# Altium project PCB_Project1.PrjPCB
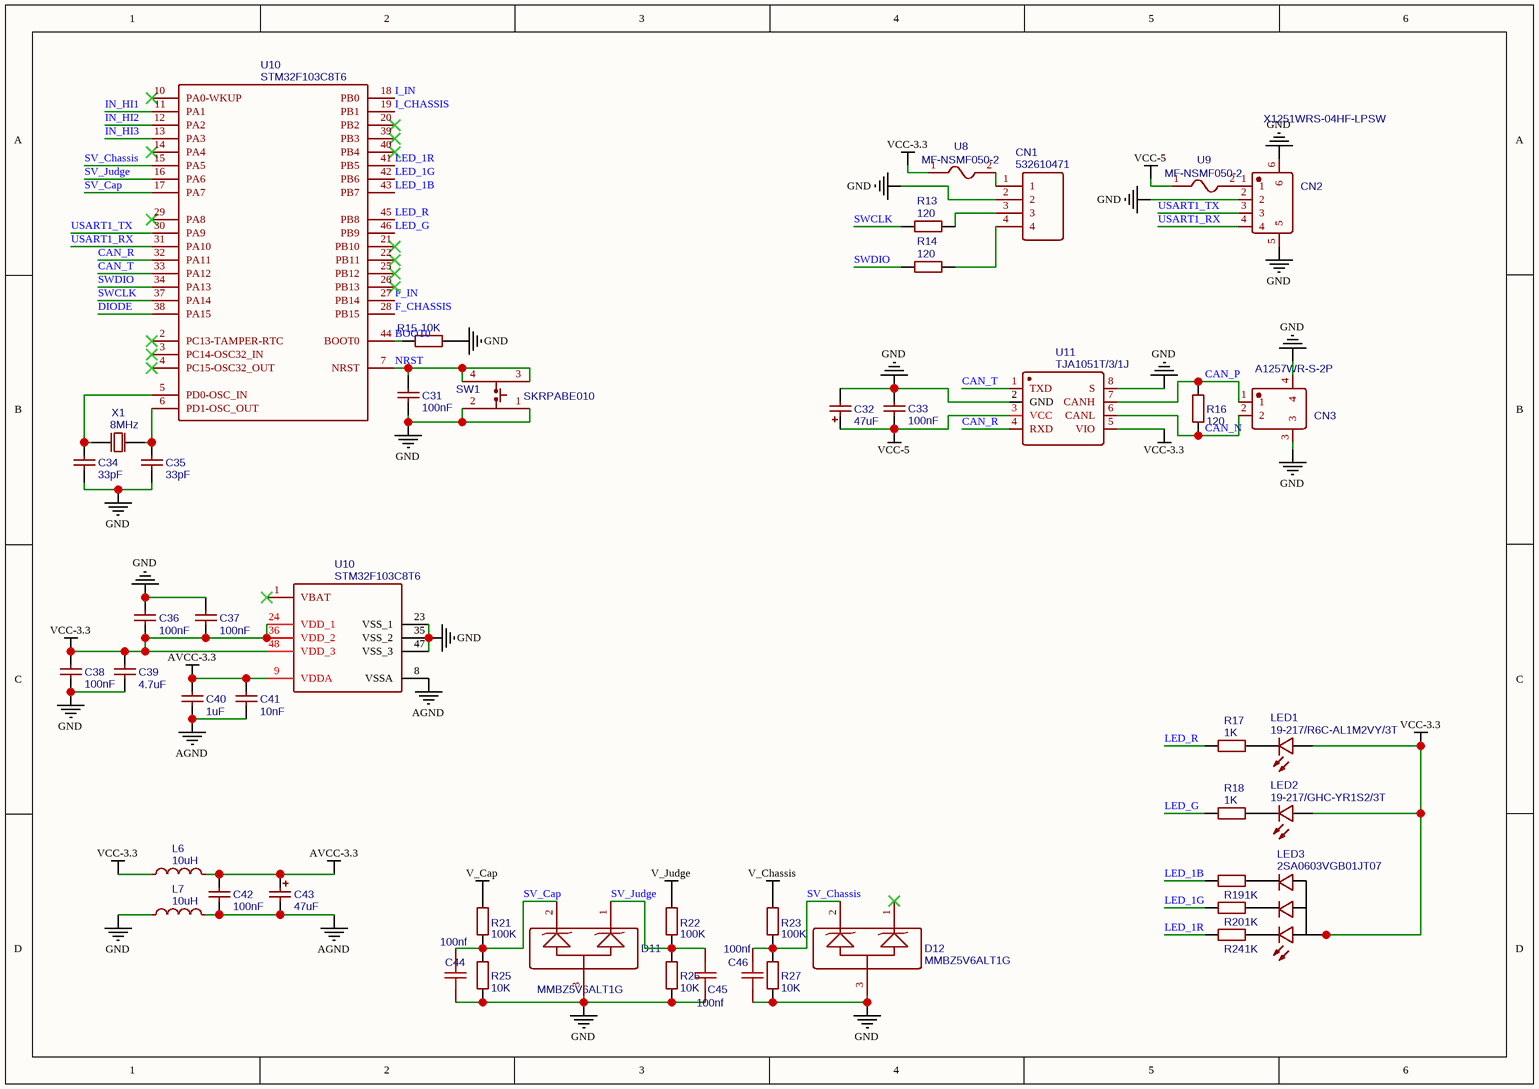
[diagram p0: F103.SchDoc]
2 sheets, 121 parts. Net scope: global (net labels, ports and power ports of the same name join across sheets).
Board file: SC1.0.pcbdoc
Sheets:
  F103.SchDoc
  SWITCH.SchDoc

## Sheet F103.SchDoc
size 287 x 202 mm

### Parts
(Parts that share a designator on the sheet are numbered #1, #2 ... from top to bottom, then left to right.)
C31  100nF  [C0603]
C32  47uF  [CASE-A_3216]
C33  100nF  [R0603]
C34  33pF  [C0603]
C35  33pF  [C0603]
C36  100nF  [C0603]
C37  100nF  [C0603]
C38  100nF  [C0603]
C39  4.7uF  [C0805]
C40  1uF  [C0603]
C41  10nF  [C0603]
C42  100nF  [C0603]
C43  47uF  [CASE-A_3216]
C44  100nf  [C0603]
C45  100nf  [C0603]
C46  100nf  [C0603]
CN1  532610471  [SMD-10.15X4.8-4P]
CN2  X1251WRS-04HF-LPSW  [CONN-TH_4PIN-H-MALE-PITCH1.25-L_X1251WRS-04HF-LPSW]
CN3  A1257WR-S-2P  [CONN-SMD_A1257WR-S-2P]
D11  MMBZ5V6ALT1G  [SOT-23(SOT-23-3)]
D12  MMBZ5V6ALT1G  [SOT-23(SOT-23-3)]
L6  10uH  [L0603]
L7  10uH  [L0603]
LED1  19-217/R6C-AL1M2VY/3T  [LED-0603]
LED2  19-217/GHC-YR1S2/3T  [LED-0603]
LED3  2SA0603VGB01JT07  [LED-SMD_4PIN-L1.60-W1.60-TL-FD]
R13  120  [R0603]
R14  120  [R0603]
R15  10K  [R0603]
R16  120  [R0603]
R17  1K  [R0603]
R18  1K  [R0603]
R19  1K  [R0603]
R20  1K  [R0603]
R21  100K  [R0603]
R22  100K  [R0603]
R23  100K  [R0603]
R24  1K  [R0603]
R25  10K  [R0603]
R26  10K  [R0603]
R27  10K  [R0603]
SW1  SKRPABE010  [KEY-SMD-4P_L4.2-W3.2-H2.5]
U8  MF-NSMF050-2  [FUSE-1206]
U9  MF-NSMF050-2  [FUSE-1206]
U10#1  STM32F103C8T6  [LQFP-48_7X7X05P]
U10#2  STM32F103C8T6  [LQFP-48_7X7X05P]
U11  TJA1051T/3/1J  [SOIC-8_150MIL]
X1  8MHz  [SMD-5032_2P]

### Nets
AGND: C40.1 C41.1 C42.1 C43.2 L7.2 U10#2.8(VSSA)
AVCC-3.3: C40.2 C41.2 C42.2 C43.1 L6.2 U10#2.9(VDDA)
GND: C31.1 C32.2 C33.2 C34.1 C35.1 C36.1 C37.2 C38.1 C39.1 C44.1 C45.1 C46.1 CN1.2 CN2.2 CN2.5 CN2.6 CN3.3 CN3.4 D11.3(A) D12.3(A) L7.1 R15.1 R25.1 R26.1 R27.1 SW1.1 SW1.2 U10#2.23(VSS_1) U10#2.35(VSS_2) U10#2.47(VSS_3) U11.2(GND) U11.8(S)
V_Cap: R21.1
V_Chassis: R23.1
V_Judge: R22.1
VCC-3.3: C36.2 C37.1 C38.2 C39.2 L6.1 LED1.1(A) LED2.1(A) LED3.1(A) U8.1 U10#2.24(VDD_1) U10#2.36(VDD_2) U10#2.48(VDD_3) U11.5(VIO)
VCC-5: C32.1 C33.1 U9.1 U11.3(VCC)
BOOT0: R15.2 U10#1.44(BOOT0)
CAN_N: CN3.2 R16.2 U11.6(CANL)
CAN_P: CN3.1 R16.1 U11.7(CANH)
CAN_R: U10#1.32(PA11) U11.4(RXD)
CAN_T: U10#1.33(PA12) U11.1(TXD)
DIODE: U10#1.38(PA15)
F_CHASSIS: U10#1.28(PB15)
F_IN: U10#1.27(PB14)
I_CHASSIS: U10#1.19(PB1)
I_IN: U10#1.18(PB0)
IN_HI1: U10#1.11(PA1)
IN_HI2: U10#1.12(PA2)
IN_HI3: U10#1.13(PA3)
LED_1B: R19.1 U10#1.43(PB7)
LED_1G: R20.1 U10#1.42(PB6)
LED_1R: R24.1 U10#1.41(PB5)
LED_G: R18.1 U10#1.46(PB9)
LED_R: R17.1 U10#1.45(PB8)
NRST: C31.2 SW1.3 SW1.4 U10#1.7(NRST)
SV_Cap: C44.2 D11.2(C) R21.2 R25.2 U10#1.17(PA7)
SV_Chassis: C46.2 D12.2(C) R23.2 R27.2 U10#1.15(PA5)
SV_Judge: C45.2 D11.1(C) R22.2 R26.2 U10#1.16(PA6)
SWCLK: R13.2 U10#1.37(PA14)
SWDIO: R14.2 U10#1.34(PA13)
USART1_RX: CN2.4 U10#1.31(PA10)
USART1_TX: CN2.3 U10#1.30(PA9)
NetC34_2: C34.2 U10#1.5(PD0-OSC_IN) X1.1(OSC1)
NetC35_2: C35.2 U10#1.6(PD1-OSC_OUT) X1.2(OSC2)
NetCN1_1: CN1.1 U8.2
NetCN1_3: CN1.3 R13.1
NetCN1_4: CN1.4 R14.1
NetCN2_1: CN2.1 U9.2
NetLED1_2: LED1.2(C) R17.2
NetLED2_2: LED2.2(C) R18.2
NetLED3_2: LED3.2(R) R24.2
NetLED3_3: LED3.3(B) R19.2
NetLED3_4: LED3.4(G) R20.2

Not connected (* = marked no-connect by the designer): D12 1(C)*; U10#1 2(PC13-TAMPER-RTC)* 3(PC14-OSC32_IN)* 4(PC15-OSC32_OUT)* 10(PA0-WKUP)* 14(PA4)* 20(PB2)* 21(PB10)* 22(PB11)* 25(PB12)* 26(PB13)* 29(PA8)* 39(PB3)* 40(PB4)*; U10#2 1(VBAT)*

### Library data of the parts
C31 C33 C36-C38 C42 = 100nF: BOM_Manufacturer Part: CL05B104KO5NNNC; BOM_Manufacturer: SAMSUNG; nameAlias: Capacitance; BOM_Supplier: LCSC; BOM_LCSC Assembly: Yes; BOM_Supplier Part: C1525; spicePre: C; spiceSymbolName: CL05B104KO5NNNC
C32 C43 = 47uF: BOM_Manufacturer: Xiangyee; BOM_Manufacturer Part: CA45-A010K476T; nameAlias: Capacitance; Contributor: LCSC; BOM_Supplier: LCSC; BOM_Supplier Part: C127069; BOM_LCSC Assembly: Yes; spicePre: C; spiceSymbolName: CA45-A010K476T
C34 C35 = 33pF: BOM_Manufacturer Part: CL05C330JB5NNNC; BOM_Manufacturer: SAMSUNG; nameAlias: Capacitance; BOM_Supplier: LCSC; BOM_Supplier Part: C70465; spicePre: C; spiceSymbolName: CL05C330JB5NNNC
C39 = 4.7uF: BOM_Manufacturer Part: CL05A475MP5NRNC; BOM_Manufacturer: SAMSUNG; nameAlias: Capacitance; BOM_Supplier: LCSC; BOM_LCSC Assembly: Yes; BOM_Supplier Part: C23733; spicePre: C; spiceSymbolName: CL05A475MP5NRNC
C40 = 1uF: BOM_Manufacturer Part: CL10A105KB8NNNC; BOM_Manufacturer: SAMSUNG; nameAlias: Capacitance; BOM_Supplier: LCSC; BOM_LCSC Assembly: Yes; BOM_Supplier Part: C15849; spicePre: C; spiceSymbolName: CL10A105KB8NNNC
C41 = 10nF: BOM_Manufacturer Part: CL05B103KB5NNNC; BOM_Manufacturer: SAMSUNG; nameAlias: Capacitance; BOM_Supplier: LCSC; BOM_LCSC Assembly: Yes; BOM_Supplier Part: C15195; spicePre: C; spiceSymbolName: CL05B103KB5NNNC
C44-C46 = 100nf: nameAlias: Value(F); spicePre: C; spiceSymbolName: Cap_0402_US
CN1 = 532610471: BOM_Manufacturer: MOLEX; BOM_Supplier: LCSC; BOM_Manufacturer Part: 532610471; BOM_Supplier Part: C127368; spicePre: C
CN2 = X1251WRS-04HF-LPSW: BOM_Manufacturer: XKB Enterprise; Contributor: LCSC; BOM_Supplier: LCSC; BOM_Supplier Part: C388709; BOM_Manufacturer Part: X1251WRS-04HF-LPSW; spicePre: C; spiceSymbolName: X1251WRS-04HF-LPSW
CN3 = A1257WR-S-2P: BOM_Manufacturer: Changjiang Connectors; Contributor: LCSC; BOM_Supplier: LCSC; BOM_Supplier Part: C225125; BOM_Manufacturer Part: A1257WR-S-2P; spicePre: C; spiceSymbolName: A1257WR-S-2P
D11 D12 = MMBZ5V6ALT1G: BOM_Manufacturer: ON; Contributor: LCSC; BOM_Supplier: LCSC; BOM_Manufacturer Part: MMBZ5V6ALT1G; BOM_Supplier Part: C123251; BOM_LCSC Assembly: Yes; spicePre: D
L6 L7 = 10uH: BOM_Manufacturer: Sunlord; BOM_Manufacturer Part: SDFL2012S100KTF; nameAlias: Inductance; SMT Type: Basic; BOM_Supplier: LCSC; BOM_LCSC Assembly: Yes; BOM_Supplier Part: C1046; spicePre: L; spiceSymbolName: SDFL2012S100KTF
LED1 = 19-217/R6C-AL1M2VY/3T: BOM_Manufacturer: EVERLIGHT; BOM_Supplier: LCSC; BOM_Manufacturer Part: 19-217/R6C-AL1M2VY/3T; image: //image.lceda.cn/szlcsc/C72044.jpg; BOM_Supplier Part: C72044; BOM_LCSC Assembly: Yes; spicePre: L
LED2 = 19-217/GHC-YR1S2/3T: BOM_Manufacturer: EVERLIGHT; BOM_Supplier: LCSC; BOM_Manufacturer Part: 19-217/GHC-YR1S2/3T; BOM_LCSC Assembly: Yes; image: //image.lceda.cn/szlcsc/C72043.jpg; BOM_Supplier Part: C72043; spicePre: L
LED3 = 2SA0603VGB01JT07: BOM_Manufacturer: Brightek Optoelectronics; Contributor: LCSC; BOM_Supplier: LCSC; BOM_Supplier Part: C233195; BOM_Manufacturer Part: 2SA0603VGB01JT07; spicePre: L; spiceSymbolName: 2SA0603VGB01JT07
R13 R14 R16 = 120: BOM_Manufacturer: UniOhm; BOM_Manufacturer Part: 0402WGF1200TCE; nameAlias: Resistance (Ohms); BOM_Supplier: LCSC; BOM_LCSC Assembly: Yes; BOM_Supplier Part: C25079; spicePre: R; spiceSymbolName: 0402WGF1200TCE
R15 = 10K: BOM_Manufacturer: UniOhm; BOM_Manufacturer Part: 0402WGF1002TCE; nameAlias: Resistance (Ohms); BOM_Supplier: LCSC; BOM_LCSC Assembly: Yes; BOM_Supplier Part: C25744; spicePre: R; spiceSymbolName: 0402WGF1002TCE
R17-R20 R24 = 1K: BOM_Manufacturer: UniOhm; BOM_Manufacturer Part: 0402WGF1001TCE; nameAlias: Resistance (Ohms); SMT Type: Basic; BOM_Supplier: LCSC; BOM_LCSC Assembly: Yes; BOM_Supplier Part: C11702; spicePre: R; spiceSymbolName: 0402WGF1001TCE
R21-R23 = 100K: BOM_Manufacturer: UniOhm; BOM_Manufacturer Part: 0402WGF1002TCE; nameAlias: Resistance (Ohms); BOM_Supplier: LCSC; BOM_LCSC Assembly: Yes; BOM_Supplier Part: C25744; spicePre: R; spiceSymbolName: 0402WGF1002TCE
R25-R27 = 10K: BOM_Manufacturer: UniOhm; BOM_Manufacturer Part: 0402WGF1001TCE; nameAlias: Resistance (Ohms); SMT Type: Basic; BOM_Supplier: LCSC; BOM_LCSC Assembly: Yes; BOM_Supplier Part: C11702; spicePre: R; spiceSymbolName: 0402WGF1001TCE
SW1 = SKRPABE010: BOM_Manufacturer: ALPS; BOM_Supplier: LCSC; BOM_Manufacturer Part: SKRPABE010; BOM_Supplier Part: C115360; spicePre: S
U8 U9 = MF-NSMF050-2: BOM_Manufacturer: BOURNS; BOM_Supplier: LCSC; BOM_Manufacturer Part: MF-NSMF050-2; BOM_Supplier Part: C75464; BOM_LCSC Assembly: Yes; spicePre: U
U10#1 U10#2 = STM32F103C8T6: BOM_Manufacturer: ST; subpart_no: 1; tags: STM32; timeStamp: 1455028086; BOM_Supplier Part: C8734; BOM_Supplier: LCSC; BOM_Manufacturer Part: STM32F103C8T6; image: http://image.lceda.cn/szlcsc/C8734.jpg; spicePre: U
U11 = TJA1051T/3/1J: BOM_Manufacturer: NXP; BOM_Supplier: LCSC; BOM_Manufacturer Part: TJA1051T/3/1J; BOM_LCSC Assembly: Yes; image: //image.lceda.cn/szlcsc/C38695.jpg; BOM_Supplier Part: C38695; spicePre: U
X1 = 8MHz: BOM_Manufacturer: Yangxing Tech; BOM_Manufacturer Part: X50328MSD2GC; nameAlias: Frequency; Contributor: LCSC; BOM_Supplier: LCSC; BOM_Supplier Part: C172361; BOM_LCSC Assembly: Yes; spicePre: X; spiceSymbolName: X50328MSD2GC_C172361

## Sheet SWITCH.SchDoc
size 316 x 191 mm
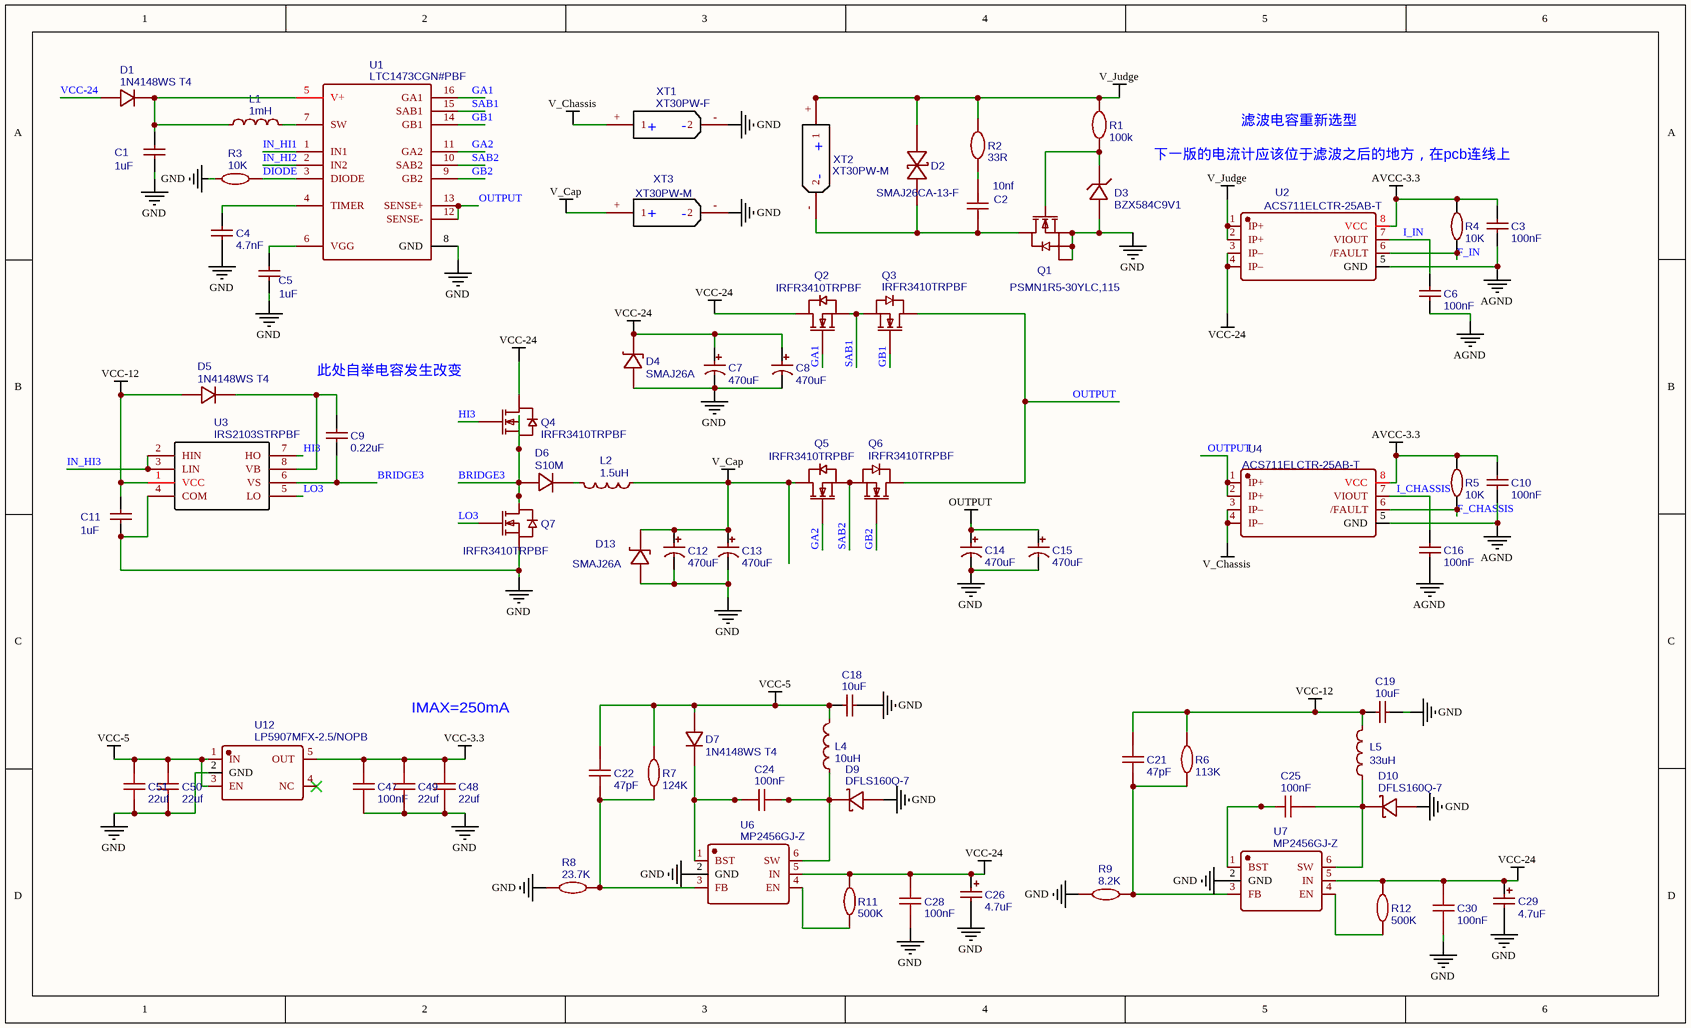
[diagram p1: SWITCH.SchDoc]

### Parts
C1  1uF  [0603]
C2  10nf  [C0603]
C3  100nF  [L0603]
C4  4.7nF  [C0603]
C5  1uF  [0603]
C6  100nF  [L0603]
C7  470uF  [CAP-D12.5XF5.0]
C8  470uF  [CAP-D12.5XF5.0]
C9  0.22uF  [C0603]
C10  100nF  [L0603]
C11  1uF  [0603]
C12  470uF  [CAP-D12.5XF5.0]
C13  470uF  [CAP-D12.5XF5.0]
C14  470uF  [CAP-D12.5XF5.0]
C15  470uF  [CAP-D12.5XF5.0]
C16  100nF  [L0603]
C18  10uF  [0805]
C19  10uF  [0805]
C21  47pF  [0603]
C22  47pF  [0603]
C24  100nF  [0603]
C25  100nF  [0603]
C26  4.7uF  [CAP-CASE-A_3216]
C28  100nF  [0603]
C29  4.7uF  [CAP-CASE-A_3216]
C30  100nF  [0603]
C47  100nF  [C0603]
C48  22uf  [C0805]
C49  22uf  [C0805]
C50  22uf  [C0805]
C51  22uf  [C0805]
D1  1N4148WS T4  [SOD-323_L1.8-W1.3-LS2.5-FD]
D2  SMAJ26CA-13-F  [SMA_L4.4-W2.6-LS5.0-BI]
D3  BZX584C9V1  [SOD-523F_L1.7-W0.9-LS1.7-RD]
D4  SMAJ26A  [SMA(DO-214AC)]
D5  1N4148WS T4  [SOD-323_L1.8-W1.3-LS2.5-FD]
D6  S10M  [SMC(DO-214AB)]
D7  1N4148WS T4  [SOD-323_L1.8-W1.3-LS2.5-FD]
D9  DFLS160Q-7  [POWERDI-123]
D10  DFLS160Q-7  [POWERDI-123]
D13  SMAJ26A  [SMA(DO-214AC)]
L1  1mH  [IND-SMD_L4.0-W4.0]
L2  1.5uH  [SMD-L-13.5X12.8X5.0]
L4  10uH  [R0603]
L5  33uH  [1008]
Q1  PSMN1R5-30YLC,115  [SOT-669_L4.9-W4.0-P1.27-LS6.0-BR]
Q2  IRFR3410TRPBF  [TO-252-2]
Q3  IRFR3410TRPBF  [TO-252-2]
Q4  IRFR3410TRPBF  [TO-252-2]
Q5  IRFR3410TRPBF  [TO-252-2]
Q6  IRFR3410TRPBF  [TO-252-2]
Q7  IRFR3410TRPBF  [TO-252-2]
R1  100k  [R0603]
R2  33R  [R0603]
R3  10K  [R0603]
R4  10K  [R0603]
R5  10K  [R0603]
R6  113K  [R0603]
R7  124K  [R0603]
R8  23.7K  [0805]
R9  8.2K  [R0603]
R11  500K  [0805]
R12  500K  [0805]
U1  LTC1473CGN#PBF  [TSSOP16]
U2  ACS711ELCTR-25AB-T  [SOIC-8_150MIL]
U3  IRS2103STRPBF  [SOIC-8_150MIL]
U4  ACS711ELCTR-25AB-T  [SOIC-8_150MIL]
U6  MP2456GJ-Z  [TSOT-23-6]
U7  MP2456GJ-Z  [TSOT-23-6]
U12  LP5907MFX-2.5/NOPB  [SOT-23-5_L3.0-W1.7-P0.95-LS2.8-BL]
XT1  XT30PW-F  [XT30_H_F]
XT2  XT30PW-M  [XT30PW]
XT3  XT30PW-M  [XT30PW]

### Nets
AGND: C3.1 C6.1 C10.1 C16.1 U2.5(GND) U4.5(GND)
AVCC-3.3: C3.2 C10.2 R4.2 R5.2 U2.8(VCC) U4.8(VCC)
GND: C1.2 C4.1 C5.2 C7.2 C8.2 C11.2 C12.2 C13.2 C14.2 C15.2 C18.2 C19.2 C26.2 C28.1 C29.2 C30.1 C47.1 C48.1 C49.1 C50.1 C51.1 D3.2(A) D4.1(A) D9.2 D10.2 D13.1(A) Q1.1(S) Q1.2(S) Q1.3(S) Q7.3(S) R3.1 R8.1 R9.1 U1.8(GND) U3.4(COM) U6.2(GND) U7.2(GND) U12.2(GND) XT1.-(2) XT3.-(2)
OUTPUT: C14.1 C15.1 Q3.4(D) Q6.4(D) U1.12(SENSE-) U1.13(SENSE+) U4.1(IP+) U4.2(IP+)
V_Cap: C12.1 C13.1 D13.2(K) L2.1 Q5.4(D) XT3.+(1)
V_Chassis: U4.3(IP–) U4.4(IP–) XT1.+(1)
V_Judge: D2.2 R1.2 R2.2 U2.1(IP+) U2.2(IP+) XT2.+(1)
VCC-3.3: C47.2 C48.2 C49.2 U12.5(OUT)
VCC-5: C18.1 C22.1 C50.2 C51.2 D7.1(A) L4.2 R7.2 U12.1(IN) U12.3(EN)
VCC-12: C11.1 C19.1 C21.1 D5.1(A) L5.2 R6.2 U3.1(VCC)
VCC-24: C7.1 C8.1 C26.1 C28.2 C29.1 C30.2 D1.1(A) D4.2(K) Q2.4(D) Q4.4(D) R11.2 R12.1 U2.3(IP–) U2.4(IP–) U6.5(IN) U7.5(IN)
BRIDGE3: C9.1 D6.1(A) Q4.3(S) Q7.4(D) U3.6(VS)
DIODE: R3.2 U1.3(DIODE)
F_CHASSIS: R5.1 U4.6(/FAULT)
F_IN: R4.1 U2.6(/FAULT)
GA1: Q2.1(G) U1.16(GA1)
GA2: Q5.1(G) U1.11(GA2)
GB1: Q3.1(G) U1.14(GB1)
GB2: Q6.1(G) U1.9(GB2)
HI3: Q4.1(G) U3.7(HO)
I_CHASSIS: C16.2 U4.7(VIOUT)
I_IN: C6.2 U2.7(VIOUT)
IN_HI1: U1.1(IN1)
IN_HI2: U1.2(IN2)
IN_HI3: U3.2(HIN) U3.3(LIN)
LO3: Q7.1(G) U3.5(LO)
SAB1: Q2.3(S) Q3.3(S) U1.15(SAB1)
SAB2: Q5.3(S) Q6.3(S) U1.10(SAB2)
NetC1_1: C1.1 D1.2(K) L1.1 U1.5(V+)
NetC2_1: C2.1 D2.1 Q1.5(D) XT2.-(2)
NetC2_2: C2.2 R2.1
NetC4_2: C4.2 U1.4(TIMER)
NetC5_1: C5.1 U1.6(VGG)
NetC9_2: C9.2 D5.2(K) U3.8(VB)
NetC21_2: C21.2 R6.1 R9.2 U7.3(FB)
NetC22_2: C22.2 R7.1 R8.2 U6.3(FB)
NetC24_1: C24.1 D7.2(K) U6.1(BST)
NetC24_2: C24.2 D9.1 L4.1 U6.6(SW)
NetC25_1: C25.1 U7.1(BST)
NetC25_2: C25.2 D10.1 L5.1 U7.6(SW)
NetD3_1: D3.1(K) Q1.4(G) R1.1
NetD6_2: D6.2(K) L2.2
NetL1_2: L1.2 U1.7(SW)
NetR11_1: R11.1 U6.4(EN)
NetR12_2: R12.2 U7.4(EN)

Not connected (* = marked no-connect by the designer): U12 4(NC)*

### Notes on the sheet
- 下一版的电流计应该位于滤波之后的地方，在pcb连线上
- 滤波电容重新选型
- (near C9) 此处自举电容发生改变
- IMAX=250mA

### Library data of the parts
C1 C5 C11 = 1uF: as C40 on sheet F103; BOM_Supplier: LCSC; BOM_LCSC Assembly: Yes; BOM_Supplier Part: C15849; spicePre: C; spiceSymbolName: CL10A105KB8NNNC
C2 = 10nf: nameAlias: Value(F); spicePre: C; spiceSymbolName: Cap_0402_US
C3 C6 C10 C16 = 100nF: as C31 on sheet F103; BOM_Supplier: LCSC; BOM_LCSC Assembly: Yes; BOM_Supplier Part: C1525; spicePre: C; spiceSymbolName: CL05B104KO5NNNC
C4 = 4.7nF: BOM_Manufacturer: FH; BOM_Manufacturer Part: 0805B472K500NT; nameAlias: Capacitance; SMT Type: Basic; BOM_Supplier: LCSC; BOM_LCSC Assembly: Yes; BOM_Supplier Part: C1744; spicePre: C; spiceSymbolName: 0805B472K500NT
C7 C8 C12-C15 = 470uF: BOM_Manufacturer: ValuePro; BOM_Manufacturer Part: 470μF 63V; nameAlias: Capacitance; BOM_Supplier: LCSC; BOM_Supplier Part: C18823; spicePre: C; spiceSymbolName: 470μF 63V
C9 = 0.22uF: nameAlias: Capacitance; BOM_Supplier: LCSC; spicePre: C; spiceSymbolName: CL10A105KB8NNNC
C18 C19 = 10uF: BOM_Manufacturer Part: CL21A106KAYNNNE; BOM_Manufacturer: SAMSUNG; nameAlias: Capacitance; SMT Type: Basic; BOM_Supplier: LCSC; BOM_LCSC Assembly: Yes; BOM_Supplier Part: C15850; spicePre: C; spiceSymbolName: CL21A106KAYNNNE
C21 C22 = 47pF: BOM_Manufacturer: YAGEO; BOM_Manufacturer Part: AC0603JRNPO9BN470; nameAlias: Capacitance; Contributor: LCSC; BOM_Supplier: LCSC; BOM_Supplier Part: C149616; spicePre: C; spiceSymbolName: AC0603JRNPO9BN470
C24 C25 C28 C30 = 100nF: BOM_Manufacturer: YAGEO; BOM_Manufacturer Part: CC0603KRX7R9BB104; nameAlias: Capacitance; SMT Type: Basic; BOM_Supplier: LCSC; BOM_LCSC Assembly: Yes; BOM_Supplier Part: C14663; spicePre: C; spiceSymbolName: CC0603KRX7R9BB104
C26 C29 = 4.7uF: BOM_Manufacturer: CEC; BOM_Manufacturer Part: CA45-A-25V-4.7UF-K; nameAlias: Capacitance; SMT Type: Extend; BOM_Supplier: LCSC; BOM_Supplier Part: C129569; BOM_LCSC Assembly: Yes; spicePre: C; spiceSymbolName: CA45-A-25V-4.7UF-K
C47 = 100nF: BOM_Manufacturer: MuRata; BOM_Manufacturer Part: GRM188R71H104KA93D; nameAlias: Capacitance; BOM_Supplier: LCSC; BOM_Supplier Part: C77055; spicePre: C; spiceSymbolName: GRM188R71H104KA93D
C48-C51 = 22uf: BOM_Manufacturer: Samsung Electro-Mechanics; nameAlias: Value; Contributor: LCSC; BOM_Supplier: LCSC; BOM_Supplier Part: C19704; BOM_Manufacturer Part: -; spicePre: C; spiceSymbolName: 22uF ±20% 10V
D1 D5 D7 = 1N4148WS T4: BOM_Manufacturer: CJ; SMT Type: Basic; BOM_Supplier: LCSC; BOM_Manufacturer Part: 1N4148WS T4; BOM_LCSC Assembly: Yes; image: //image.lceda.cn/szlcsc/C2128.jpg; BOM_Supplier Part: C2128; spicePre: D
D2 = SMAJ26CA-13-F: BOM_Manufacturer: DIODES; Contributor: LCSC; SMT Type: Extend; BOM_Supplier: LCSC; BOM_Manufacturer Part: SMAJ26CA-13-F; BOM_Supplier Part: C134976; BOM_LCSC Assembly: Yes; spicePre: D; spiceSymbolName: SMAJ26CA-13-F
D3 = BZX584C9V1: SMT Type: Extend; BOM_Supplier: LCSC; BOM_LCSC Assembly: Yes; spicePre: D; spiceSymbolName: BZX584C12-V-G-08
D4 D13 = SMAJ26A: BOM_Manufacturer: RUILON; BOM_Supplier: LCSC; BOM_Manufacturer Part: SMAJ26A; image: //image.lceda.cn/szlcsc/C49370.jpg; BOM_Supplier Part: C49370; BOM_LCSC Assembly: Yes; spicePre: D
D6 = S10M: BOM_Manufacturer: MDD; Package Display: No; BOM_Supplier: LCSC; BOM_Manufacturer Part: S10M; BOM_Supplier Part: C64933; BOM_LCSC Assembly: Yes; spicePre: D
D9 D10 = DFLS160Q-7: BOM_Manufacturer: Diodes Incorporated; Contributor: LCSC; BOM_Supplier: LCSC; BOM_Supplier Part: C211394; BOM_Manufacturer Part: DFLS160Q-7; spicePre: D
L1 = 1mH: BOM_Manufacturer: CENKER; BOM_Manufacturer Part: CKCS4030-1mH/M; nameAlias: Inductance; Contributor: LCSC; BOM_Supplier: LCSC; BOM_Supplier Part: C354594; spicePre: L; spiceSymbolName: CKCS4030-1MH/M
L2 = 1.5uH: BOM_Manufacturer: Sunlord; BOM_Manufacturer Part: MWSA1205-1R5MT; nameAlias: Inductance; Contributor: LCSC; BOM_Supplier: LCSC; BOM_Supplier Part: C149569; spicePre: L; spiceSymbolName: MWSA1205-1R5MT
L4 = 10uH: as L6 on sheet F103; BOM_Supplier: LCSC; BOM_LCSC Assembly: Yes; BOM_Supplier Part: C1046; spicePre: L; spiceSymbolName: SDFL2012S100KTF
L5 = 33uH: BOM_Manufacturer: TDK; BOM_Manufacturer Part: NLV25T-330J-PF; nameAlias: Inductance; BOM_Supplier: LCSC; BOM_Supplier Part: C136257; spicePre: L; spiceSymbolName: NLV25T-330J-PF
Q1 = PSMN1R5-30YLC,115: BOM_Manufacturer: Nexperia; Contributor: LCSC; BOM_Supplier: LCSC; BOM_Supplier Part: C427523; BOM_Manufacturer Part: PSMN1R5-30YLC,115; spicePre: Q; spiceSymbolName: PSMN1R5-30YLC,115
Q2-Q7 = IRFR3410TRPBF: BOM_Manufacturer: Infineon; BOM_Supplier: LCSC; BOM_Manufacturer Part: IRFR3410TRPBF; image: //image.lceda.cn/szlcsc/C3016.jpg; BOM_Supplier Part: C3016; BOM_LCSC Assembly: Yes; spicePre: Q
R1 = 100k: nameAlias: Value(Ω); spicePre: R; spiceSymbolName: Res_AXIAL-0.3(1/8W)_EU
R2 = 33R: nameAlias: Value(Ω); spicePre: R; spiceSymbolName: Res_AXIAL-0.3(1/8W)_EU
R3 = 10K: BOM_Manufacturer: PANASONIC; BOM_Manufacturer Part: ERJ-6RBD1002V; nameAlias: Resistance (Ohms); Contributor: LCSC; BOM_Supplier: LCSC; BOM_Supplier Part: C191557; spicePre: R; spiceSymbolName: ERJ-6RBD1002V
R4 R5 = 10K: as R15 on sheet F103; BOM_Supplier: LCSC; BOM_LCSC Assembly: Yes; BOM_Supplier Part: C25744; spicePre: R; spiceSymbolName: 0402WGF1002TCE
R6 = 113K: BOM_Manufacturer: YAGEO; BOM_Manufacturer Part: AC0805FR-07113KL; nameAlias: Resistance (Ohms); Contributor: LCSC; BOM_Supplier: LCSC; BOM_Supplier Part: C228262; spicePre: R; spiceSymbolName: AC0805FR-07113KL
R7 = 124K: BOM_Manufacturer: YAGEO; BOM_Manufacturer Part: AC0805FR-07124KL; nameAlias: Resistance (Ohms); Contributor: LCSC; BOM_Supplier: LCSC; BOM_Supplier Part: C228280; spicePre: R; spiceSymbolName: AC0805FR-07124KL
R8 = 23.7K: BOM_Manufacturer: Guangdong Fenghua Advanced Tech; BOM_Manufacturer Part: RS-05K2372FT; nameAlias: Resistance (Ohms); Contributor: LCSC; BOM_Supplier: LCSC; BOM_Supplier Part: C322370; spicePre: R; spiceSymbolName: RS-05K2372FT
R9 = 8.2K: BOM_Manufacturer: WTC; BOM_Manufacturer Part: WR08X822JTL; nameAlias: Resistance (Ohms); Contributor: LCSC; BOM_Supplier: LCSC; BOM_Supplier Part: C171042; spicePre: R; spiceSymbolName: WR08X822JTL
R11 R12 = 500K: BOM_Manufacturer: Viking Tech; BOM_Manufacturer Part: AR05BTCW5003; nameAlias: Resistance (Ohms); Contributor: LCSC; BOM_Supplier: LCSC; BOM_Supplier Part: C316218; spicePre: R; spiceSymbolName: AR05BTCW5003
U2 U4 = ACS711ELCTR-25AB-T: BOM_Manufacturer: Allegro MicroSystems, LLC; Contributor: LCSC; BOM_Supplier: LCSC; BOM_Supplier Part: C114268; BOM_Manufacturer Part: ACS711ELCTR-25AB-T; BOM_LCSC Assembly: Yes; spicePre: U
U3 = IRS2103STRPBF: BOM_Manufacturer: IR; SMT Type: Extend; BOM_Supplier: LCSC; BOM_Manufacturer Part: IRS2103STRPBF; image: //image.lceda.cn/szlcsc/C2958.jpg; BOM_Supplier Part: C2958; BOM_LCSC Assembly: Yes; spicePre: U
U6 U7 = MP2456GJ-Z: BOM_Manufacturer: MPS; BOM_Supplier: LCSC; BOM_Manufacturer Part: MP2456GJ-Z; BOM_Supplier Part: C88045; spicePre: U
U12 = LP5907MFX-2.5/NOPB: BOM_Manufacturer: TI; Contributor: LCSC; SMT Type: Extend; BOM_Supplier: LCSC; BOM_Manufacturer Part: LP5907MFX-2.5/NOPB; BOM_Supplier Part: C165132; BOM_LCSC Assembly: Yes; spicePre: U; spiceSymbolName: LP5907MFX-2.5/NOPB
XT1 = XT30PW-F: BOM_Manufacturer Part: XT60; Contributor: 4bucks; Package Display: No; spicePre: X
XT2 XT3 = XT30PW-M: BOM_Manufacturer Part: XT60; Contributor: 4bucks; Package Display: No; spicePre: X
U1 = LTC1473CGN#PBF: spicePre: U

## Nets that join several sheets
AGND: F103 (6 pins), SWITCH (6 pins)
AVCC-3.3: F103 (6 pins), SWITCH (6 pins)
GND: F103 (32 pins), SWITCH (40 pins)
V_Cap: F103 (R21.1), SWITCH (6 pins)
V_Chassis: F103 (R23.1), SWITCH (U4.3 U4.4 XT1.+)
V_Judge: F103 (R22.1), SWITCH (6 pins)
VCC-3.3: F103 (13 pins), SWITCH (C47.2 C48.2 C49.2 U12.5)
VCC-5: F103 (C32.1 C33.1 U9.1 U11.3), SWITCH (9 pins)
DIODE: F103 (U10#1.38), SWITCH (R3.2 U1.3)
F_CHASSIS: F103 (U10#1.28), SWITCH (R5.1 U4.6)
F_IN: F103 (U10#1.27), SWITCH (R4.1 U2.6)
I_CHASSIS: F103 (U10#1.19), SWITCH (C16.2 U4.7)
I_IN: F103 (U10#1.18), SWITCH (C6.2 U2.7)
IN_HI1: F103 (U10#1.11), SWITCH (U1.1)
IN_HI2: F103 (U10#1.12), SWITCH (U1.2)
IN_HI3: F103 (U10#1.13), SWITCH (U3.2 U3.3)